# EAGLE design fabflash-mk-2-driver (EAGLE 6.5.0)
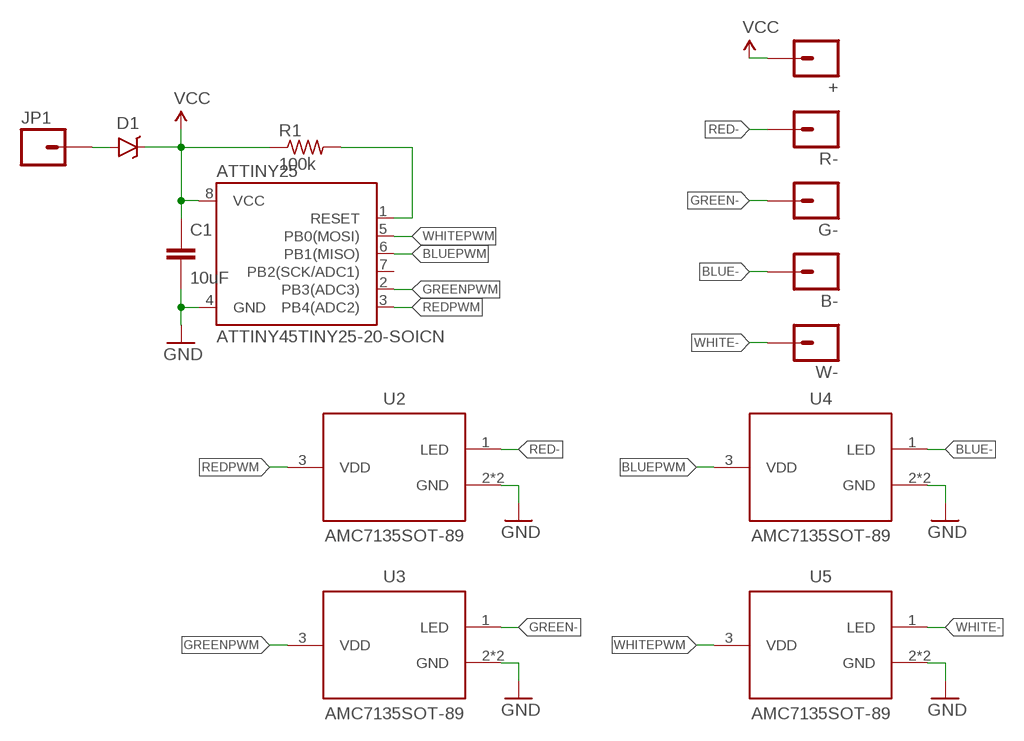
[diagram p0: schematic, sheet 1]

## Parts
+  M01PTH-0.9MM  [1X01-0.9MM-NS]
ATTINY25  ATTINY45TINY25-20-SOICN  [SO08]
B-  M01PTH-0.9MM  [1X01-0.9MM-NS]
C1  10uF  CAPACITOR-CERAMICC0805  [C0805]
D1  MBRA140  DIODE-SCHOTTKYMBRA140  [SMA-DIODE]
G-  M01PTH-0.9MM  [1X01-0.9MM-NS]
JP1  M01NOT-A-VIA-NOPE  [1X01_NOSILK_NOSTOP]
R1  100k  RESISTORR0805  [R0805]
R-  M01PTH-0.9MM  [1X01-0.9MM-NS]
U2  AMC7135SOT-89  [SOT89]
U3  AMC7135SOT-89  [SOT89]
U4  AMC7135SOT-89  [SOT89]
U5  AMC7135SOT-89  [SOT89]
W-  M01PTH-0.9MM  [1X01-0.9MM-NS]

## Nets
BATT+: D1.A JP1.P$1
BLUE-: B-.1 U4.1(LED)
BLUEPWM: ATTINY25.6(PB1(MISO)) U4.3(VDD)
GND: ATTINY25.4(GND) C1.2 U2.2(GND) U2.4(GND) U3.2(GND) U3.4(GND) U4.2(GND) U4.4(GND) U5.2(GND) U5.4(GND)
GREEN-: G-.1 U3.1(LED)
GREENPWM: ATTINY25.2(PB3(ADC3)) U3.3(VDD)
RED-: R-.1 U2.1(LED)
REDPWM: ATTINY25.3(PB4(ADC2)) U2.3(VDD)
RESET: ATTINY25.1(RESET) R1.2
VCC: +.1 ATTINY25.8(VCC) C1.1 D1.C R1.1
WHITE-: U5.1(LED) W-.1
WHITEPWM: ATTINY25.5(PB0(MOSI)) U5.3(VDD)
Unconnected: ATTINY25.7(PB2(SCK/ADC1))

## Library data of the parts
+ B- G- JP1 R- W- = A_butts:M01: Header 1 Standard 1-pin 0.1" header. Use with straight break away headers (SKU : PRT-00116), right angle break away headers (PRT-00553), swiss pins (PRT-00743), machine pins (PRT-00117), and female headers (PRT-00115).
ATTINY25 = A_butts:ATTINY45: Atmel 8-pin 2/4/8kB flash uC
C1 = A_butts:CAPACITOR-CERAMIC: CAPACITOR, European symbol
D1 = A_butts:DIODE-SCHOTTKY: Schottky diodes in SFE's production catalog BAT20J 1A 23V 0.62Vf RB751 120mA 40V 0.37Vf PMEG4005EJ 0.5A 40V 0.42Vf MBRA140 1A 40V 0.5Vf B340A 3A 40V SMA; PROD_ID: DIO-08053
R1 = A_butts:RESISTOR: RESISTOR, American symbol
U2-U5 = A_butts:AMC7135

## Board
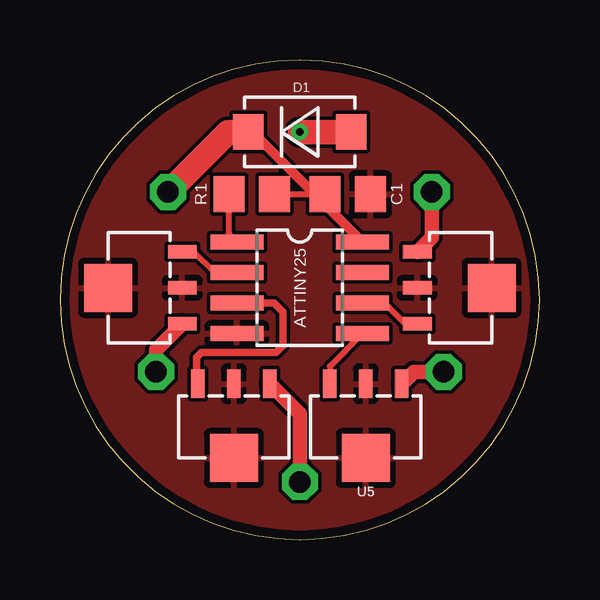
[diagram p1: board, top side]
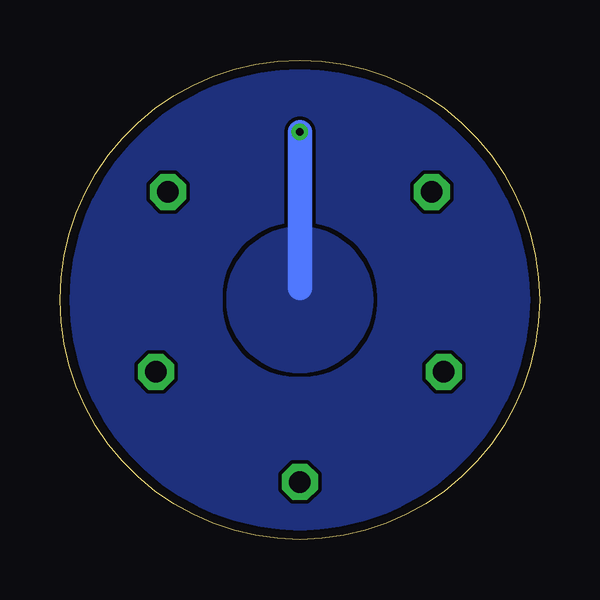
[diagram p2: board, bottom side, seen from below]

Size 20 x 20 mm. Coordinates in mm from the lower left corner, seen from the top.
Outline: 0,10 arc90 10,0 arc90 20,10 arc90 10,20 arc90 0,10
Copper layers (1*16): Top 0.0356mm / dielectric 1.5011mm / Bottom 0.0356mm
Design rules "LaenPCBOrder2": minimum track width 6mil, minimum drill 13mil, track to track 6mil, track to pad 6mil, pad to pad 6mil, via to via 6mil, smd to smd 6mil, copper to edge 15mil, drill to drill 6mil, minimum pad ring 7mil, minimum via ring 7mil, stop-mask expansion 3mil, vias tented up to drill 20mil, thermal gap 10mil

### Footprints (pad centres in the part's own frame; a part is rotated, then mirrored left to right if it is on the bottom)
1X01-0.9MM-NS = drill 0.9 pad 1.5 octagon: 1 0,0
SO08 = smd 0.61 x 2.21: 1 -1.905,-2.616; 2 -0.635,-2.616; 3 0.635,-2.616; 4 1.905,-2.616; 5 1.905,2.616; 6 0.635,2.616; 7 -0.635,2.616; 8 -1.905,2.616
C0805 = smd 1.3 x 1.5: 1 -0.95,0; 2 0.95,0
SMA-DIODE = smd 1.27 x 1.47: A -2.15,0; C 2.15,0
1X01_NOSILK_NOSTOP = drill 0.33: P$1 0,0
R0805 = smd 1.3 x 1.5: 1 -0.95,0; 2 0.95,0
SOT89 = smd 0.58 x 1.2: 1 -1.5,-1.8; 2 0,-1.8; 3 1.5,-1.8 | smd 2 x 2: 4 0,1.3

### Placement (x,y rotation side)
+  4.5,14.5 90 top
ATTINY25  10,10.5 270 top
B-  15.5,14.5 0 top
C1  12,14.4 0 top
D1  10,17 180 top
G-  4,7 90 top
JP1  10,17 0 top
R1  8,14.4 180 top
R-  10,2.4 180 top
U2  7.25,4.7 180 top
U3  3.3,10.5 90 top
U4  16.7,10.5 270 top
U5  12.75,4.7 180 top
W-  16,7 270 top

### Tracks (layer width: path | path; a pad name or v marks a point on that pad's centre or on a via)
BATT+
  Top 1.016: D1.A JP1.P$1
  Bottom 1.016: JP1.P$1 10,10.5
  pour Bottom: 7,10 arc90 10,7 arc90 13,10 arc90 10,13 arc90
BATT-
  pour Bottom (rank 6): 10,0 arc-90 0,10 arc-90 10,20 arc-90 20,10 arc-90
BLUE-
  Top 0.61: U4.1 15.5,12.6 B-.1
BLUEPWM
  Top 0.254: ATTINY25.6 13.54,9.87 14.4,9 U4.3
GND
  pour Top: 10,0 arc-90 0,10 arc-90 10,20 arc-90 20,10 arc-90
GREEN-
  Top 0.61: G-.1 4,7.9 U3.1
GREENPWM
  Top 0.254: ATTINY25.2 6.46,11.13 5.6,12 U3.3
RED-
  Top 0.61: U2.1 10,5.25 R-.1
REDPWM
  Top 0.305: ATTINY25.3 8.94,9.87 9.3,9.5 9.3,8.1 9,7.8 5.9,7.8 5.7,7.6 5.7,6.55 U2.3
RESET
  Top 0.254: ATTINY25.1 7.05,12.74 R1.2
VCC
  Top 0.254: R1.1 C1.1
  Top 0.406: D1.C 8.02,17 10.91,14.11 | 10.91,14.11 ATTINY25.8 | C1.1 11.05,14.25 10.91,14.11
  Top 1.016: D1.C 7,17 +.1
WHITE-
  Top 0.61: U5.1 14.75,7 W-.1
WHITEPWM
  Top 0.254: ATTINY25.5 11.25,7.23 U5.3